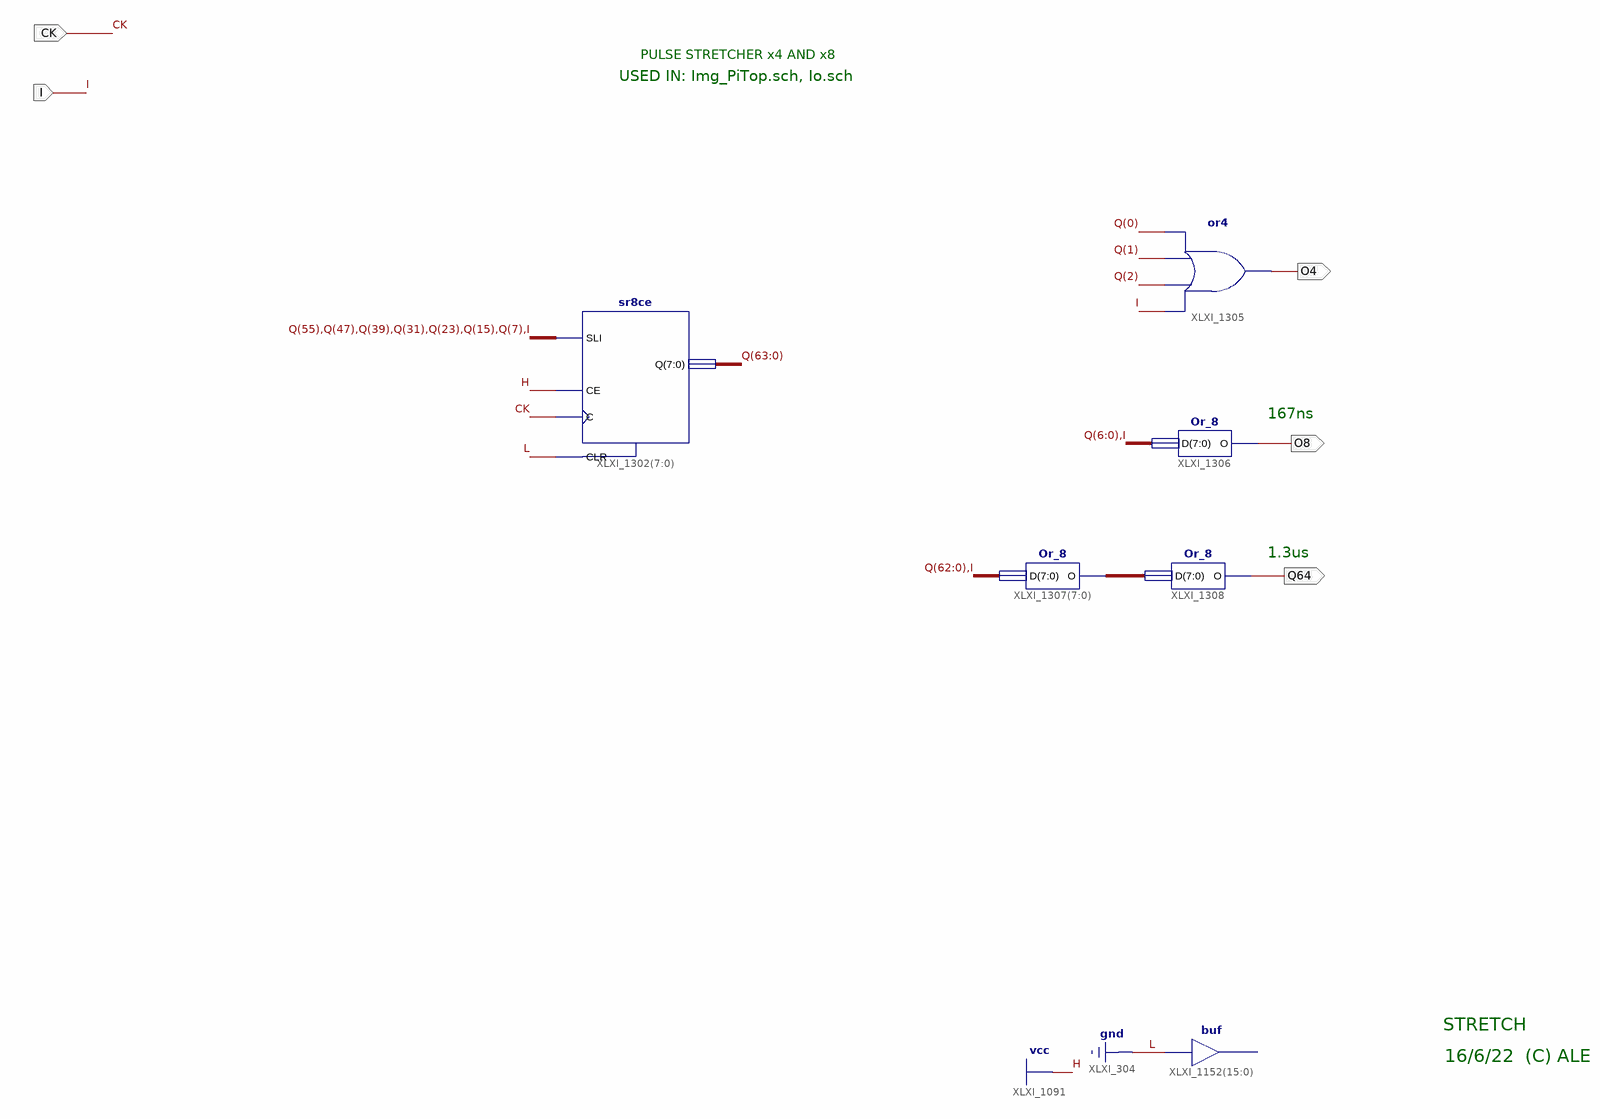
[diagram p0: schematic sheet 1]
// Xilinx ISE schematic Stretch.sch (spartan3e) as structural Verilog: 6 symbols, 5 ports
module Stretch (
  input  I,
  input  CK,
  output O4,
  output O8,
  output Q64
);

  wire [7:0] XLXN_2;
  wire [63:0] Q;

  // buf XLXI_1152[15..0] has open pins: I=1'b0, O=open
  sr8ce XLXI_1302[7:0] (
    .C(CK), .CE(1'b1), .CLR(1'b0), .SLI({Q[55], Q[47], Q[39], Q[31], Q[23], Q[15], Q[7], I}), .Q(Q));
  or XLXI_1305 (O4, I, Q[2], Q[1], Q[0]);
  Or_8 XLXI_1306 (.D({Q[6:0], I}), .O(O8));
  Or_8 XLXI_1307[7:0] (.D({Q[62:0], I}), .O(XLXN_2));
  Or_8 XLXI_1308 (.D(XLXN_2), .O(Q64));

  // Notes on the sheet:
  //   PULSE STRETCHER x4 AND x8
  //   USED IN: Img_PiTop.sch, Io.sch
  //   167ns
  //   1.3us
  //   STRETCH
  //   16/6/22  (C) ALE
endmodule
